# EAGLE design cpx-synth1 (EAGLE 8.6.3)
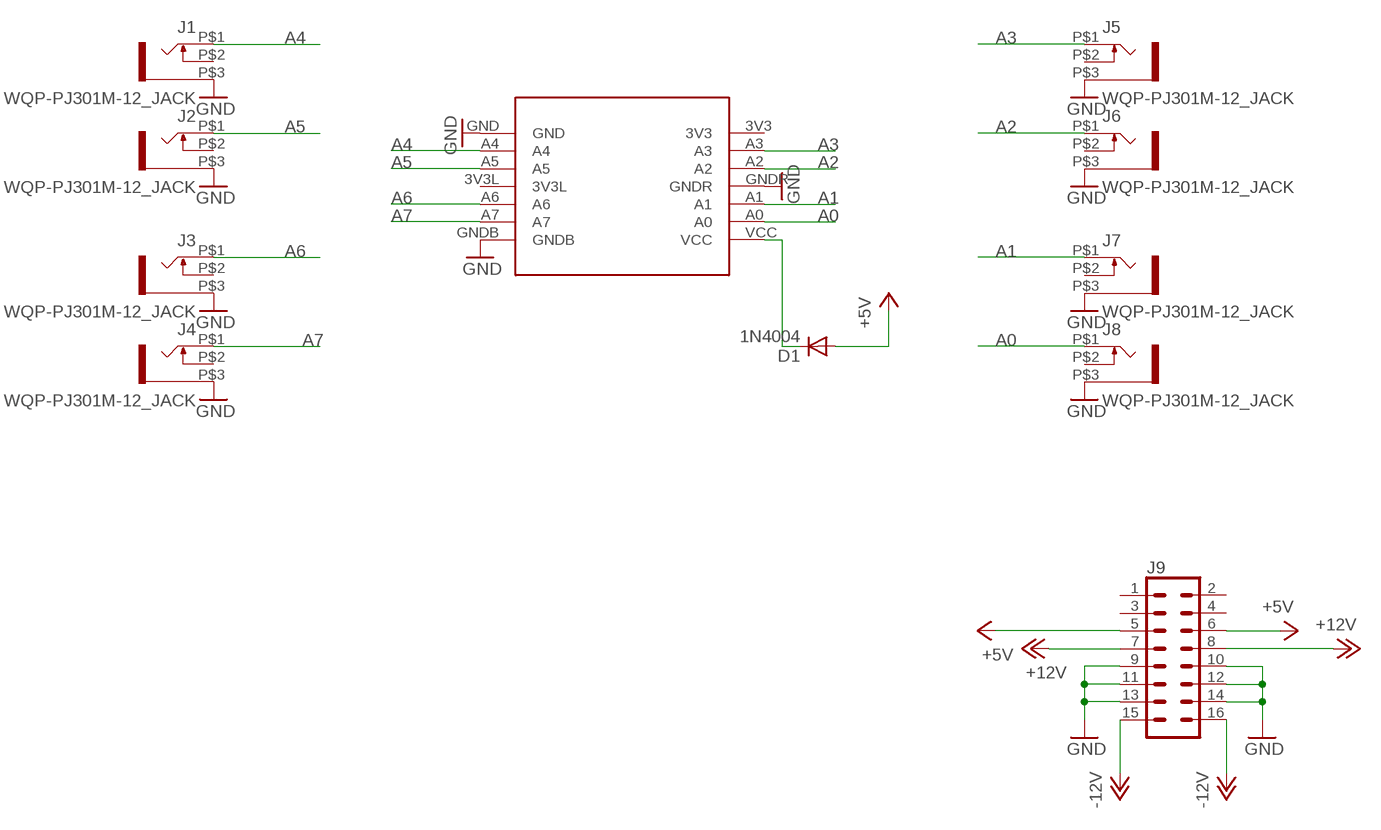
[diagram p0: schematic, sheet 1]

## Parts
D1  1N4004  [DO41-10]
J1  WQP-PJ301M-12_JACK  [WQP-PJ301M-12_JACK]
J2  WQP-PJ301M-12_JACK  [WQP-PJ301M-12_JACK]
J3  WQP-PJ301M-12_JACK  [WQP-PJ301M-12_JACK]
J4  WQP-PJ301M-12_JACK  [WQP-PJ301M-12_JACK]
J5  WQP-PJ301M-12_JACK  [WQP-PJ301M-12_JACK]
J6  WQP-PJ301M-12_JACK  [WQP-PJ301M-12_JACK]
J7  WQP-PJ301M-12_JACK  [WQP-PJ301M-12_JACK]
J8  WQP-PJ301M-12_JACK  [WQP-PJ301M-12_JACK]
J9  CONN_08X2  [2X8]
U1  CIRCUITPLAYGROUNDEXPRESS  [CIRCUITPLAYGROUNDEXPRESS]

## Nets
+5V: D1.A J9.5 J9.6
+12V: J9.7 J9.8
-12V: J9.15 J9.16
A0: J8.P$1 U1.A0
A1: J7.P$1 U1.A1
A2: J6.P$1 U1.A2
A3: J5.P$1 U1.A3
A4: J1.P$1 U1.A4
A5: J2.P$1 U1.A5
A6: J3.P$1 U1.A6
A7: J4.P$1 U1.A7
GND: J1.P$3 J2.P$3 J3.P$3 J4.P$3 J5.P$3 J6.P$3 J7.P$3 J8.P$3 J9.9 J9.10 J9.11 J9.12 J9.13 J9.14 U1.GND U1.GNDB U1.GNDR
N$1: D1.C U1.VCC
Unconnected: J1.P$2 J2.P$2 J3.P$2 J4.P$2 J5.P$2 J6.P$2 J7.P$2 J8.P$2 J9.1 J9.2 J9.3 J9.4 U1.3V3 U1.3V3L

## Library data of the parts
D1 = adafruit:1N4004: DIODE General purpose 1N400x type rectifier (With bigger pads) http://www.ladyada.net/library/pcb/eaglelibrary.html
J1-J8 = thonkiconn:WQP-PJ301M-12_JACK
J9 = SparkFun-Connectors:CONN_08X2: Multi connection point. Often used as Generic Header-pin footprint for 0.1 inch spaced/style header connections You can populate with any combo of single row headers, but if you'd like an exact match, check this: Header - 2x8 (Male, 0.1") <https://www.sparkfun.com/products/13156> (PRT-13156) On any of the 0.1 inch spaced packages, you can populate with these: Break Away Headers - Straight <https://www.sparkfun.com/products/116> (PRT-00116) Break Away Male Headers - Right Angle <https://www.sparkfun.com/products/553> (PRT-00553) Female Headers <https://www.sparkfun.com/products/115> (PRT-00115) Break Away Headers - Machine Pin <https://www.sparkfun.com/products/117> (PRT-00117) Break Away Female Headers - Swiss Machine Pin <https://www.sparkfun.com/products/743> (PRT-00743)
U1 = todstuff:CIRCUITPLAYGROUNDEXPRESS

## Board
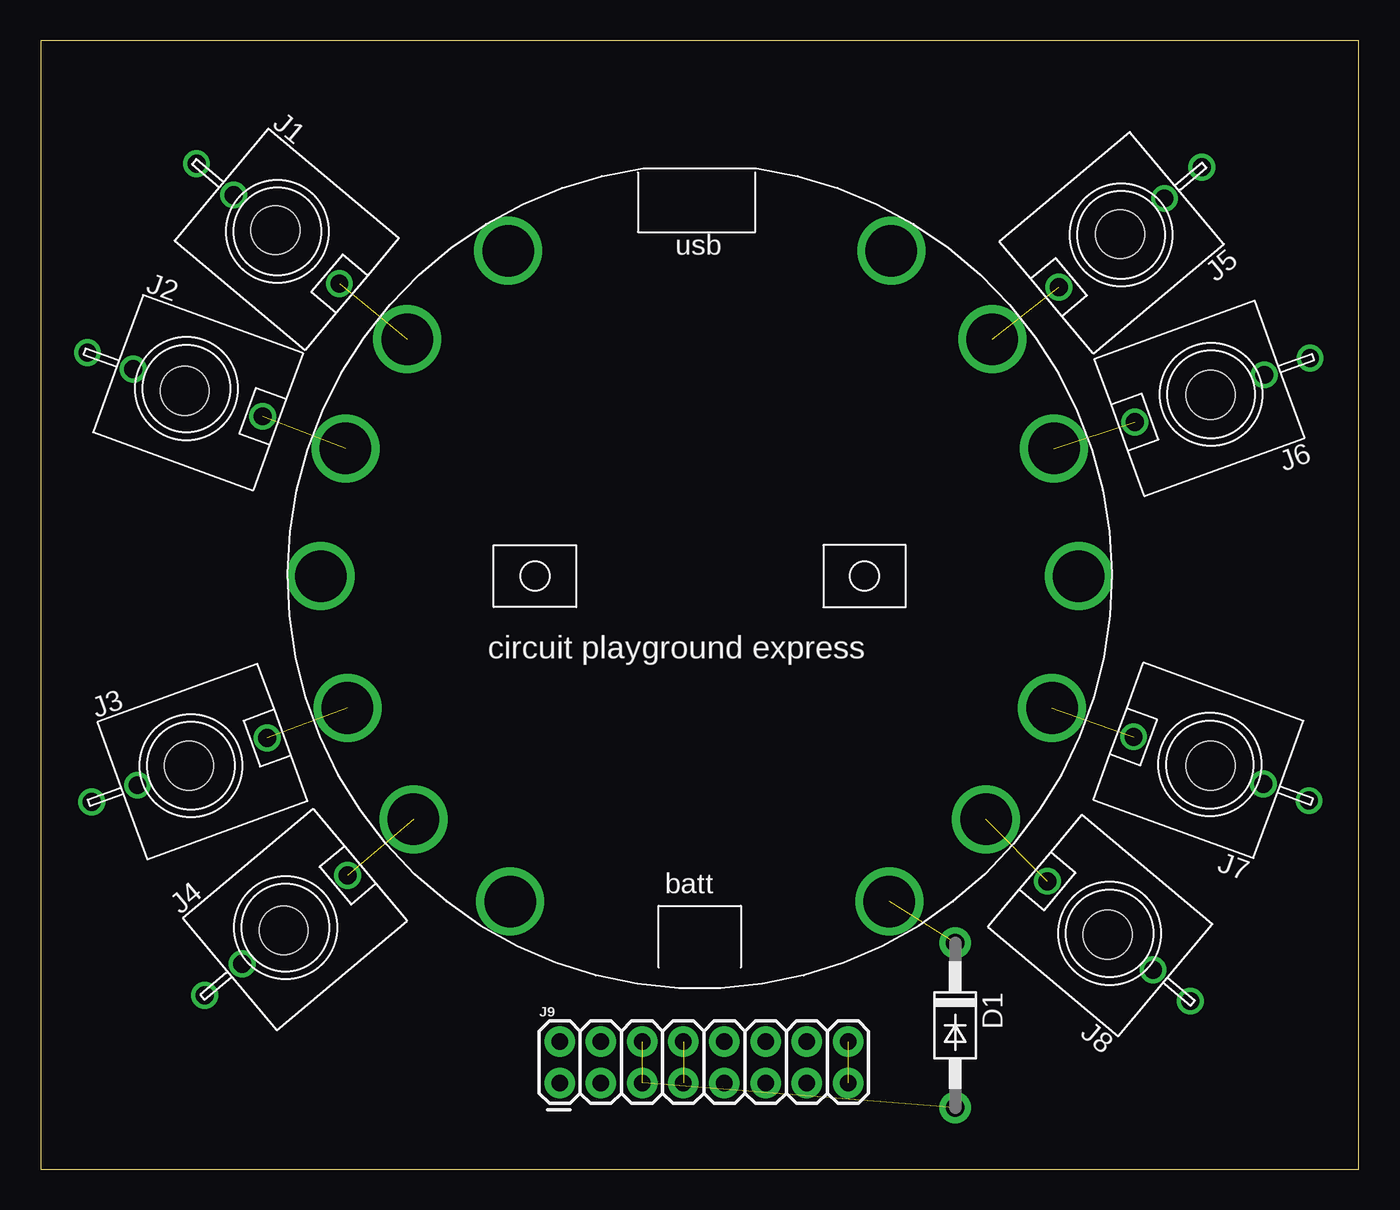
[diagram p1: board, top side]
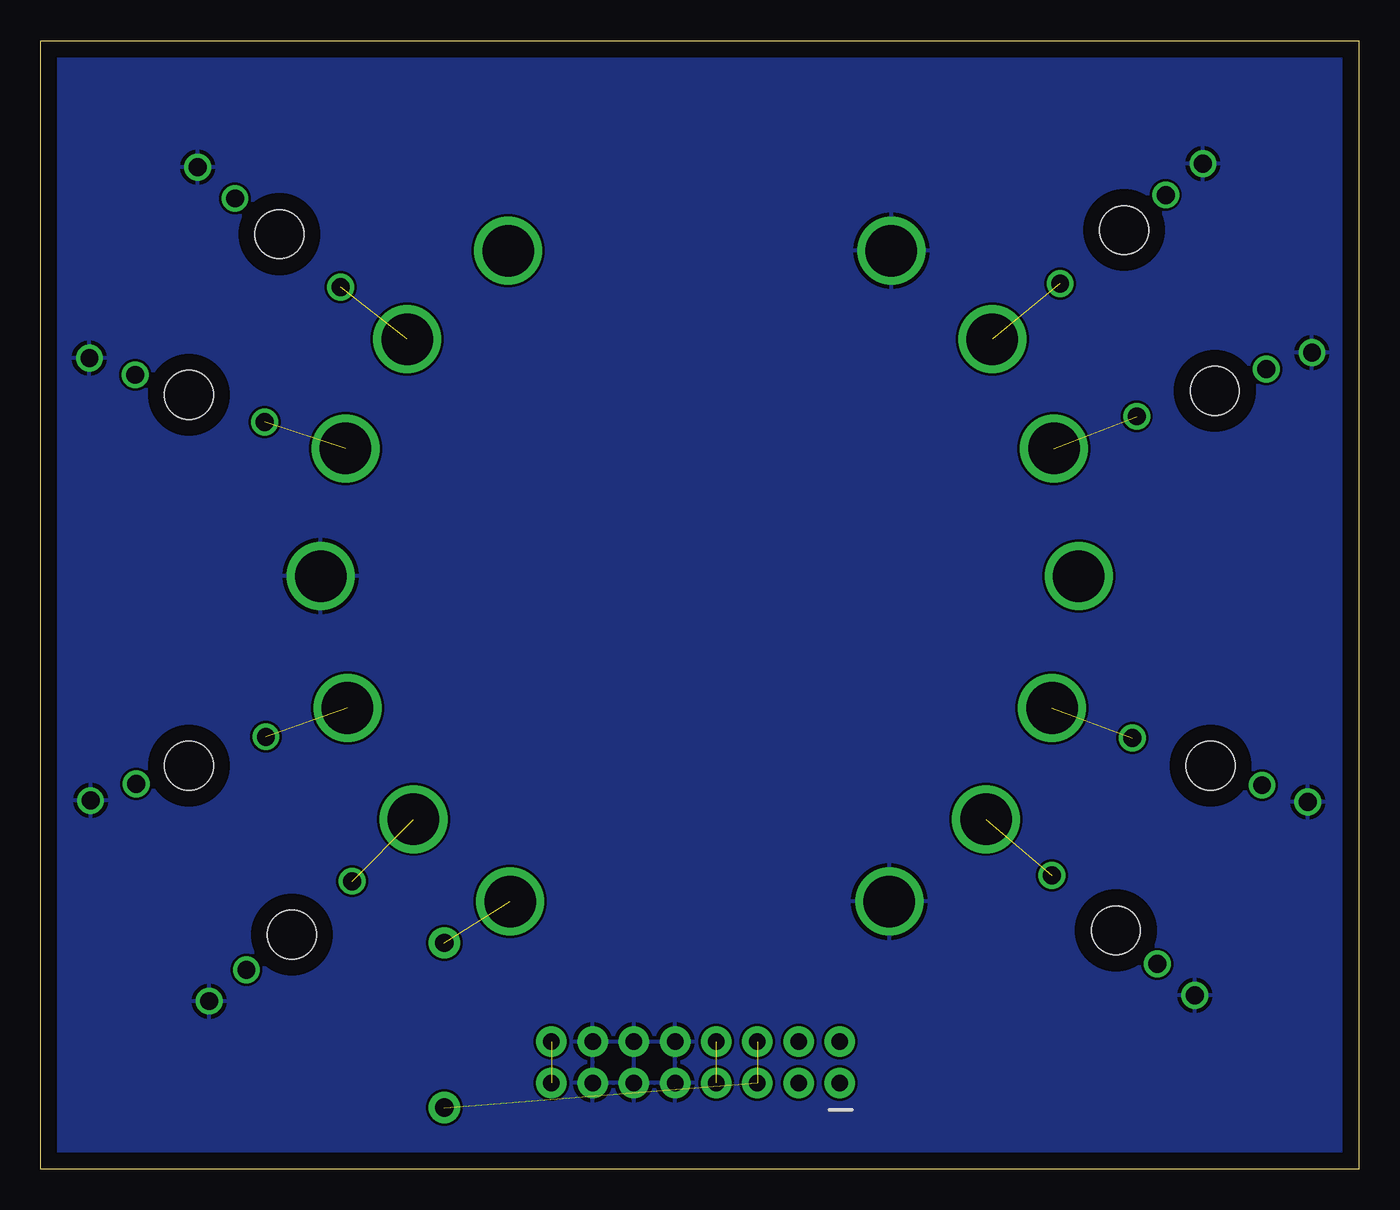
[diagram p2: board, bottom side, seen from below]

Size 81.28 x 69.6 mm. Coordinates in mm from the lower left corner, seen from the top.
Outline: 0,0 81.28,0 81.28,69.6 0,69.6 0,0
Copper layers (1*16): Top 0.035mm / dielectric 1.5mm / Bottom 0.035mm
Design rules "default": minimum track width 6mil, minimum drill 0.35mm, track to track 6mil, track to pad 6mil, pad to pad 6mil, via to via 6mil, smd to smd 6mil, copper to edge 40mil, drill to drill 6mil, minimum pad ring 10mil, minimum via ring 8mil, stop-mask expansion 4mil, vias tented up to drill 0mil, thermal gap 10mil
Holes 3 mm at 14.48,57.91 8.89,48.01 9.14,24.89 14.99,14.73 65.79,14.48 72.14,24.89 72.14,47.75 66.55,57.66

### Footprints (pad centres in the part's own frame; a part is rotated, then mirrored left to right if it is on the bottom)
DO41-10 = drill 1.118 pad 1.93: A 5.08,0; C -5.08,0
WQP-PJ301M-12_JACK = drill 1.1: P$1 0,5; P$2 0,-3.5; P$3 0,-6.5
2X8 = drill 1.016 pad 1.88: 1 0,0; 2 0,2.54; 3 2.54,0; 4 2.54,2.54; 5 5.08,0; 6 5.08,2.54; 7 7.62,0; 8 7.62,2.54; 9 10.16,0; 10 10.16,2.54; 11 12.7,0; 12 12.7,2.54; 13 15.24,0; 14 15.24,2.54; 15 17.78,0; 16 17.78,2.54
CIRCUITPLAYGROUNDEXPRESS = drill 3.175: 3V3 11.811,20.066; 3V3L -23.368,0; A0 17.653,-14.986; A1 21.717,-8.128; A2 21.844,7.874; A3 18.034,14.605; A4 -18.034,14.605; A5 -21.844,7.874; A6 -21.717,-8.128; A7 -17.653,-14.986; GND -11.811,20.066; GNDB -11.684,-20.066; GNDR 23.368,0; VCC 11.684,-20.066

### Placement (x,y rotation side)
D1  56.39,8.89 270 top
J1  14.59,57.82 230 top
J2  9,48.14 250 top
J3  9.27,24.88 290 top
J4  15.1,14.91 310 top
J5  66.61,57.61 130 top
J6  72.16,47.79 110 top
J7  72.09,24.96 70 top
J8  65.9,14.55 50 top
J9  32,5.33 0 top
U1  40.64,36.58 0 top

### Tracks (layer width: path | path; a pad name or v marks a point on that pad's centre or on a via)
+5V  (2 unrouted)
+12V  (1 unrouted)
-12V  (1 unrouted)
A0  (1 unrouted)
A1  (1 unrouted)
A2  (1 unrouted)
A3  (1 unrouted)
A4  (1 unrouted)
A5  (1 unrouted)
A6  (1 unrouted)
A7  (1 unrouted)
GND
  pour Bottom: 0,74.68 83.82,74.68 83.82,-1.52 0,-1.52
N$1  (1 unrouted)